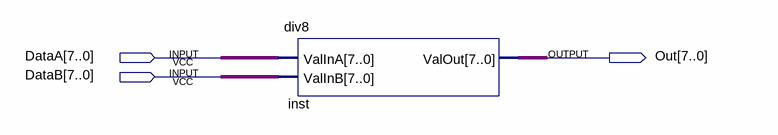
[diagram p0: schematic sheet]
// Quartus schematic Test_one.bdf as structural Verilog: 1 symbols, 3 pins
module Test_one (
  input  [7:0] DataA,
  input  [7:0] DataB,
  output [7:0] Out
);

  div8 inst (.ValInA(DataA), .ValInB(DataB), .ValOut(Out));
endmodule
